# EAGLE schematic labwiz-module_t420-0.2 (EAGLE 6.5.0)

## Sheet 1 of 2
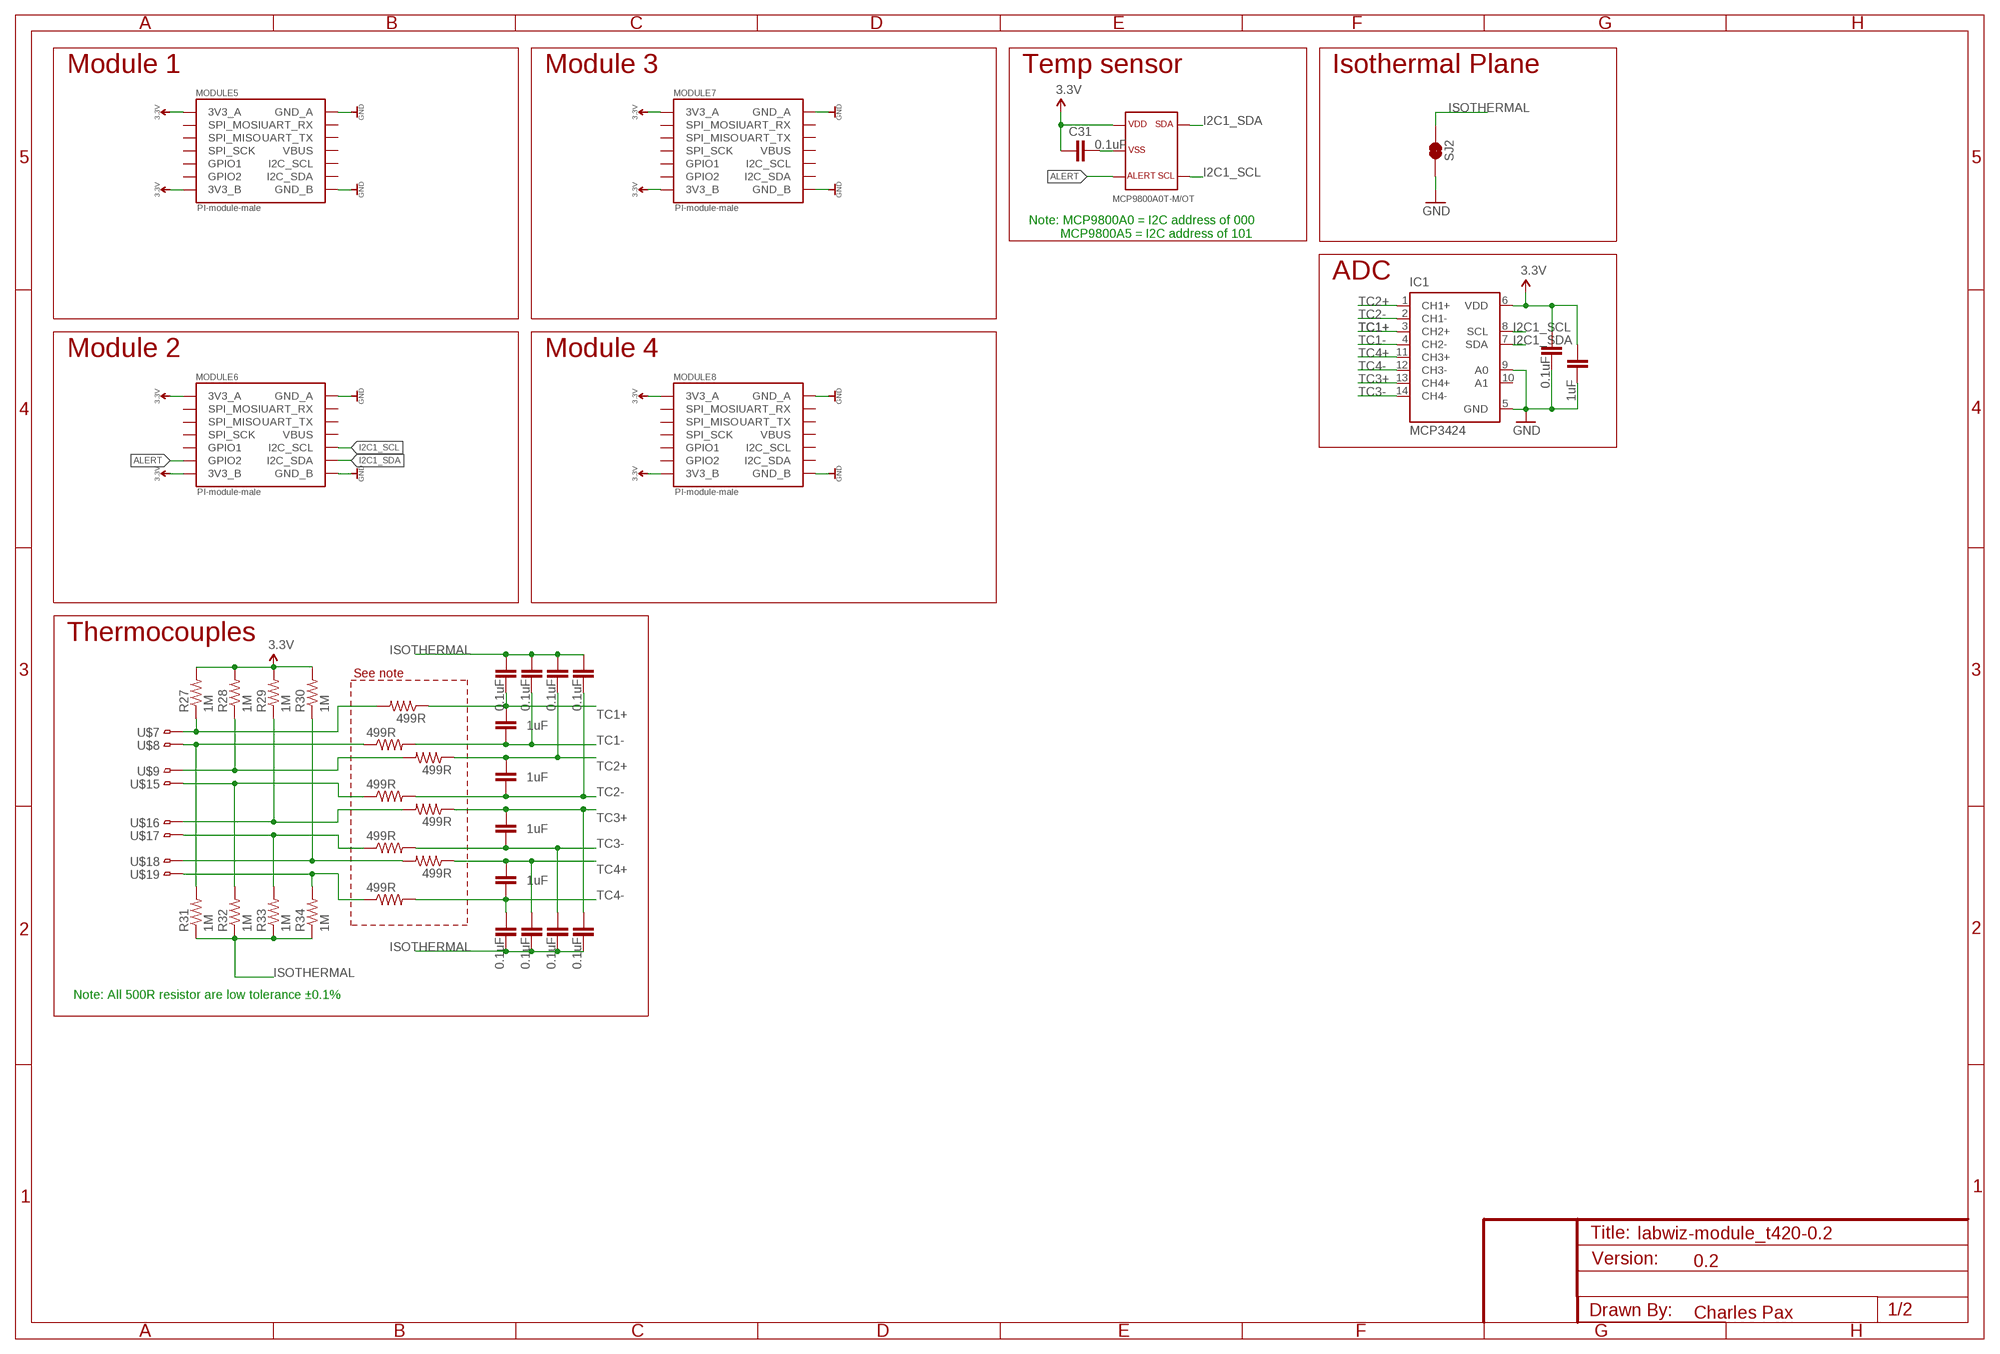
[diagram p0: schematic, sheet 1]

### Parts
C7  1uF  SPARKFUN-CAPACITORS_CAP0603-CAP  [SPARKFUN-CAPACITORS_0603-CAP]
C8  1uF  SPARKFUN-CAPACITORS_CAP0603-CAP  [SPARKFUN-CAPACITORS_0603-CAP]
C10  1uF  SPARKFUN-CAPACITORS_CAP0603-CAP  [SPARKFUN-CAPACITORS_0603-CAP]
C11  1uF  SPARKFUN-CAPACITORS_CAP0603-CAP  [SPARKFUN-CAPACITORS_0603-CAP]
C13  0.1uF  SPARKFUN-CAPACITORS_CAP0603-CAP  [SPARKFUN-CAPACITORS_0603-CAP]
C14  0.1uF  SPARKFUN-CAPACITORS_CAP0603-CAP  [SPARKFUN-CAPACITORS_0603-CAP]
C15  0.1uF  SPARKFUN-CAPACITORS_CAP0603-CAP  [SPARKFUN-CAPACITORS_0603-CAP]
C16  0.1uF  SPARKFUN-CAPACITORS_CAP0603-CAP  [SPARKFUN-CAPACITORS_0603-CAP]
C17  0.1uF  SPARKFUN-CAPACITORS_CAP0603-CAP  [SPARKFUN-CAPACITORS_0603-CAP]
C24  0.1uF  SPARKFUN-CAPACITORS_CAP0603-CAP  [SPARKFUN-CAPACITORS_0603-CAP]
C25  0.1uF  SPARKFUN-CAPACITORS_CAP0603-CAP  [SPARKFUN-CAPACITORS_0603-CAP]
C29  0.1uF  SPARKFUN-CAPACITORS_CAP0603-CAP  [SPARKFUN-CAPACITORS_0603-CAP]
C30  1uF  SPARKFUN-CAPACITORS_CAP0603-CAP  [SPARKFUN-CAPACITORS_0603-CAP]
C31  0.1uF  SPARKFUN-CAPACITORS_CAP0603-CAP  [SPARKFUN-CAPACITORS_0603-CAP]
C37  0.1uF  SPARKFUN-CAPACITORS_CAP0603-CAP  [SPARKFUN-CAPACITORS_0603-CAP]
IC1  MCP3424  [SO14]
MODULE5  PI-module-male  PAX_MODULE_EDGE_MALE_MODULE  [M07X2_2MM_EDGE]
MODULE6  PI-module-male  PAX_MODULE_EDGE_MALE_MODULE  [M07X2_2MM_EDGE]
MODULE7  PI-module-male  PAX_MODULE_EDGE_MALE_MODULE  [M07X2_2MM_EDGE]
MODULE8  PI-module-male  PAX_MODULE_EDGE_MALE_MODULE  [M07X2_2MM_EDGE]
R27  1M  SPARKFUN-RESISTORS_RESISTOR0603-RES  [SPARKFUN-RESISTORS_0603-RES]
R28  1M  SPARKFUN-RESISTORS_RESISTOR0603-RES  [SPARKFUN-RESISTORS_0603-RES]
R29  1M  SPARKFUN-RESISTORS_RESISTOR0603-RES  [SPARKFUN-RESISTORS_0603-RES]
R30  1M  SPARKFUN-RESISTORS_RESISTOR0603-RES  [SPARKFUN-RESISTORS_0603-RES]
R31  1M  SPARKFUN-RESISTORS_RESISTOR0603-RES  [SPARKFUN-RESISTORS_0603-RES]
R32  1M  SPARKFUN-RESISTORS_RESISTOR0603-RES  [SPARKFUN-RESISTORS_0603-RES]
R33  1M  SPARKFUN-RESISTORS_RESISTOR0603-RES  [SPARKFUN-RESISTORS_0603-RES]
R34  1M  SPARKFUN-RESISTORS_RESISTOR0603-RES  [SPARKFUN-RESISTORS_0603-RES]
R35  499R  SPARKFUN-RESISTORS_RESISTOR0603-RES  [SPARKFUN-RESISTORS_0603-RES]
R36  499R  SPARKFUN-RESISTORS_RESISTOR0603-RES  [SPARKFUN-RESISTORS_0603-RES]
R37  499R  SPARKFUN-RESISTORS_RESISTOR0603-RES  [SPARKFUN-RESISTORS_0603-RES]
R38  499R  SPARKFUN-RESISTORS_RESISTOR0603-RES  [SPARKFUN-RESISTORS_0603-RES]
R39  499R  SPARKFUN-RESISTORS_RESISTOR0603-RES  [SPARKFUN-RESISTORS_0603-RES]
R40  499R  SPARKFUN-RESISTORS_RESISTOR0603-RES  [SPARKFUN-RESISTORS_0603-RES]
R41  499R  SPARKFUN-RESISTORS_RESISTOR0603-RES  [SPARKFUN-RESISTORS_0603-RES]
R42  499R  SPARKFUN-RESISTORS_RESISTOR0603-RES  [SPARKFUN-RESISTORS_0603-RES]
SJ2  JUMPER-PAD-2-NC_BY_TRACE  [PAD-JUMPER-2-NC_BY_TRACE_YES_SILK]
U1  MCP9800  [SOT23-5L]
U$7  TC-MINI-SINGLE  [TC-CLIP-SINGLE]
U$8  TC-MINI-SINGLE  [TC-CLIP-SINGLE]
U$9  TC-MINI-SINGLE  [TC-CLIP-SINGLE]
U$15  TC-MINI-SINGLE  [TC-CLIP-SINGLE]
U$16  TC-MINI-SINGLE  [TC-CLIP-SINGLE]
U$17  TC-MINI-SINGLE  [TC-CLIP-SINGLE]
U$18  TC-MINI-SINGLE  [TC-CLIP-SINGLE]
U$19  TC-MINI-SINGLE  [TC-CLIP-SINGLE]

### Nets
3.3V: C29.1 C30.1 C31.1 IC1.6(VDD) MODULE5.P$1(3V3_B) MODULE5.P$13(3V3_A) MODULE6.P$1(3V3_B) MODULE6.P$13(3V3_A) MODULE7.P$1(3V3_B) MODULE7.P$13(3V3_A) MODULE8.P$1(3V3_B) MODULE8.P$13(3V3_A) R27.2 R28.2 R29.2 R30.2 U1.1
ALERT: MODULE6.P$3(GPIO2) U1.3
GND: C29.2 C30.2 IC1.5(GND) IC1.9(A0) MODULE5.P$2(GND_B) MODULE5.P$14(GND_A) MODULE6.P$2(GND_B) MODULE6.P$14(GND_A) MODULE7.P$2(GND_B) MODULE7.P$14(GND_A) MODULE8.P$2(GND_B) MODULE8.P$14(GND_A) SJ2.1
I2C1_SCL: IC1.8(SCL) MODULE6.P$6(I2C_SCL) U1.4
I2C1_SDA: IC1.7(SDA) MODULE6.P$4(I2C_SDA) U1.5
ISOTHERMAL: C13.2 C14.2 C15.2 C16.2 C17.1 C24.1 C25.1 C31.2 C37.1 R31.1 R32.1 R33.1 R34.1 SJ2.2 U1.2
N$1: R27.1 R35.2 U$7.P$1
N$4: R32.2 R38.1 U$15.P$1
N$5: R31.2 R36.1 U$8.P$1
N$10: R28.1 R37.2 U$9.P$1
N$12: R30.1 R40.2 U$18.P$1
N$13: R29.1 R39.2 U$16.P$1
N$14: R33.2 R41.1 U$17.P$1
N$16: R34.2 R42.1 U$19.P$1
TC1+: C7.1 C17.2 IC1.3(CH2+) R35.1
TC1-: C7.2 C24.2 IC1.4(CH2-) R36.2
TC2+: C8.1 C25.2 IC1.1(CH1+) R37.1
TC2-: C8.2 C37.2 IC1.2(CH1-) R38.2
TC3+: C10.1 C16.1 IC1.13(CH4+) R39.1
TC3-: C10.2 C15.1 IC1.14(CH4-) R41.2
TC4+: C11.1 C14.1 IC1.11(CH3+) R40.1
TC4-: C11.2 C13.1 IC1.12(CH3-) R42.2
Unconnected: IC1.10(A1) MODULE5.P$3(GPIO2) MODULE5.P$4(I2C_SDA) MODULE5.P$5(GPIO1) MODULE5.P$6(I2C_SCL) MODULE5.P$7(SPI_SCK) MODULE5.P$8(VBUS) MODULE5.P$9(SPI_MISO) MODULE5.P$10(UART_TX) MODULE5.P$11(SPI_MOSI) MODULE5.P$12(UART_RX) MODULE6.P$5(GPIO1) MODULE6.P$7(SPI_SCK) MODULE6.P$8(VBUS) MODULE6.P$9(SPI_MISO) MODULE6.P$10(UART_TX) MODULE6.P$11(SPI_MOSI) MODULE6.P$12(UART_RX) MODULE7.P$3(GPIO2) MODULE7.P$4(I2C_SDA) MODULE7.P$5(GPIO1) MODULE7.P$6(I2C_SCL) MODULE7.P$7(SPI_SCK) MODULE7.P$8(VBUS) MODULE7.P$9(SPI_MISO) MODULE7.P$10(UART_TX) MODULE7.P$11(SPI_MOSI) MODULE7.P$12(UART_RX) MODULE8.P$3(GPIO2) MODULE8.P$4(I2C_SDA) MODULE8.P$5(GPIO1) MODULE8.P$6(I2C_SCL) MODULE8.P$7(SPI_SCK) MODULE8.P$8(VBUS) MODULE8.P$9(SPI_MISO) MODULE8.P$10(UART_TX) MODULE8.P$11(SPI_MOSI) MODULE8.P$12(UART_RX)

### Notes on the sheet
- Module 1 | Module 3 | Temp sensor | Isothermal Plane
- Note: MCP9800A0 = I2C address of 000
           MCP9800A5 = I2C address of 101
- ADC
- Module 2 | Module 4
- Thermocouples
- See note
- Note: All 500R resistor are low tolerance ±0.1%
- 0.2
- Charles Pax

## Sheet 2 of 2

## Library data of the parts
C7 C8 C10 C11 C13-C17 C24 C25 C29-C31 C37 = PaxInstrument-T400:SPARKFUN-CAPACITORS_CAP: Capacitor Standard 0603 ceramic capacitor, and 0.1" leaded capacitor.
IC1 = JeeLabs:MCP3424: 18-Bit, 4-Channel Sampling ANALOG-TO-DIGITAL CONVERTER with I2C? Interface Source: www.ti.com .. ADS7828.pdf; MF: Microchip Technology; MPN: MCP3424-E/SL
MODULE5-MODULE8 = PaxInstruments-Connectors:PAX_MODULE; MF: Pax Instruments; MPN: PIxxxx
R27-R34 = PaxInstrument-T400:SPARKFUN-RESISTORS_RESISTOR: Resistor Basic schematic elements and footprints for 0603, 1206, and PTH resistors.
R35-R42 = PaxInstrument-T400:SPARKFUN-RESISTORS_RESISTOR: Resistor Basic schematic elements and footprints for 0603, 1206, and PTH resistors.; MF: Vishay; MPN: TNPW0603499RBEEA
SJ2 = SparkFun-Passives:JUMPER-PAD-2-NC_BY_TRACE; MF: N/A; MPN: N/A
U1 = newparts_2010:MCP9800: Temperature sensor I2C output, Microchip. Farnell 1439485; MF: Microchip Technology; MPN: MCP9800A0T-M/OT
U$7-U$9 U$15-U$19 = PaxInstruments-Connectors:TC-MINI-SINGLE; MF: Pax Instrument; MPN: Thermo-clip2

## Net classes
0 Digital signal: width 0.1 mm, drill 0.2 mm, clearance 0.15 mm
1 3.3V power: width 0.1 mm, drill 0.2 mm, clearance 0.15 mm
2 RTC battery: width 0.1 mm, drill 0.2 mm, clearance 0.15 mm
3 5V power: width 0.1 mm, drill 0.2 mm, clearance 0.15 mm
4 Analog signal: width 0.1 mm, drill 0.2 mm, clearance 0.15 mm
5 GND: width 0.1 mm, drill 0.2 mm, clearance 0.15 mm